# EAGLE design strobe-pcb (EAGLE 9.5.1)
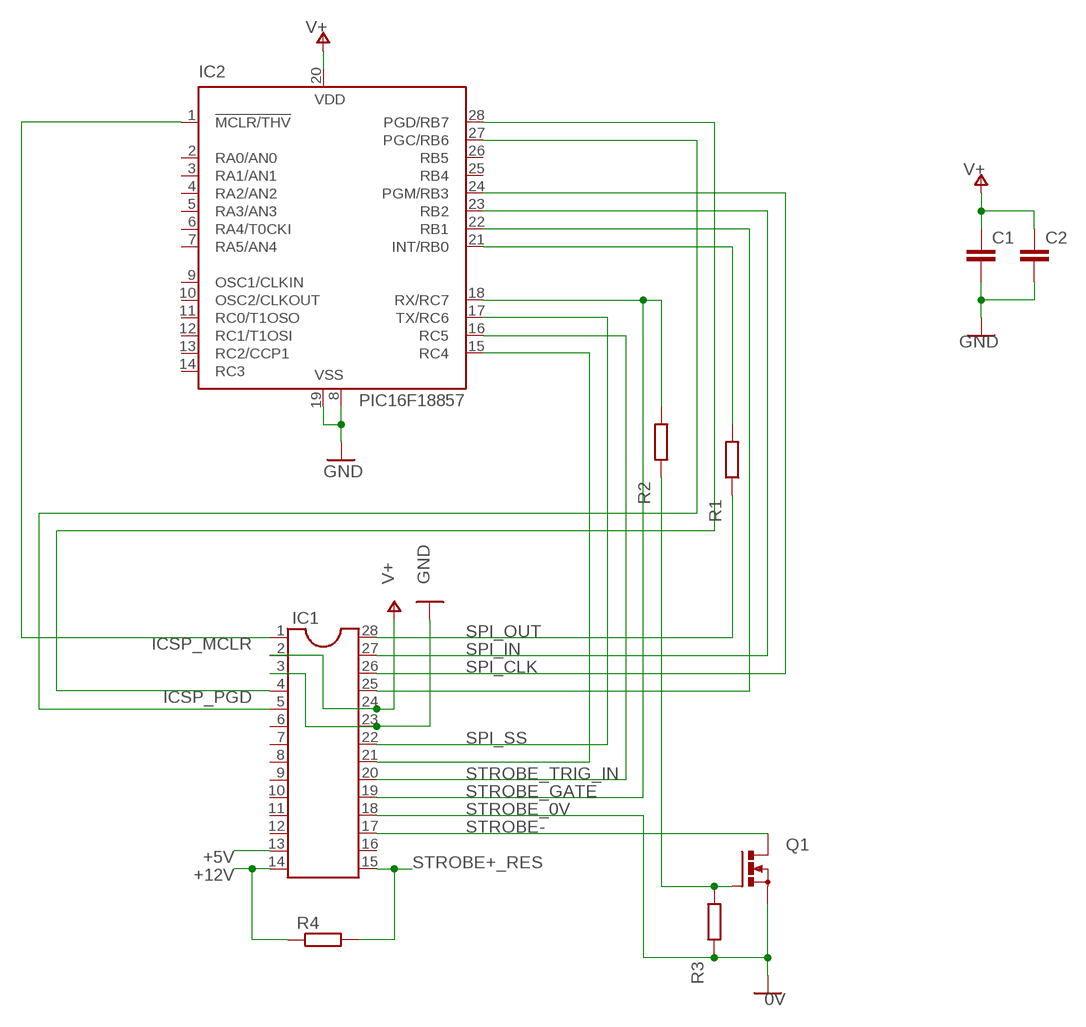
[diagram p0: schematic, sheet 1]

## Parts
C1  C-EUC1206  [C1206]
C2  C-EUC1206  [C1206]
IC1  DIL28  [DIL28-6]
IC2  PIC16F18857  PIC16F870SO  [SO28W]
Q1  PMOSFET_NTO220BV  [TO220BV]
R1  R-EU_R1206  [R1206]
R2  R-EU_R1206  [R1206]
R3  R-EU_R1206  [R1206]
R4  R-EU_0207/10  [0207/10]

## Nets
+5V: IC1.13
+12V: IC1.14 R4.1
GND: C1.2 C2.2 IC1.3 IC1.23 IC2.8(VSS) IC2.19(VSS)
ICSP_MCLR: IC1.1 IC2.1(!MCLR/THV)
ICSP_PGD: IC1.4 IC2.28(PGD/RB7)
N$1: IC1.25 IC2.22(RB1)
N$2: IC2.21(INT/RB0) R1.2
N$8: IC1.5 IC2.27(PGC/RB6)
N$12: Q1.G R2.1 R3.2
N$14: IC1.21 IC2.15(RC4)
SPI_CLK: IC1.26 IC2.24(PGM/RB3)
SPI_IN: IC1.27 IC2.23(RB2)
SPI_OUT: IC1.28 R1.1
SPI_SS: IC1.22 IC2.17(TX/RC6)
STROBE+_RES: IC1.15 R4.2
STROBE-: IC1.17 Q1.D
STROBE_0V: IC1.18 Q1.S R3.1 ; supply symbol labelled 0V
STROBE_GATE: IC1.19 IC2.18(RX/RC7) R2.2
STROBE_TRIG_IN: IC1.20 IC2.16(RC5)
V+: C1.1 C2.1 IC1.2 IC1.24 IC2.20(VDD)
Unconnected: IC1.6 IC1.7 IC1.8 IC1.9 IC1.10 IC1.11 IC1.12 IC1.16 IC2.2(RA0/AN0) IC2.3(RA1/AN1) IC2.4(RA2/AN2) IC2.5(RA3/AN3) IC2.6(RA4/T0CKI) IC2.7(RA5/AN4) IC2.9(OSC1/CLKIN) IC2.10(OSC2/CLKOUT) IC2.11(RC0/T1OSO) IC2.12(RC1/T1OSI) IC2.13(RC2/CCP1) IC2.14(RC3) IC2.25(RB4) IC2.26(RB5)

## Library data of the parts
C1 C2 = rcl:C-EU: CAPACITOR, European symbol; SPICEPREFIX: C
IC1 = ic-package:DIL28: Dual In Line
IC2 = microchip:PIC16*870: MICROCONTROLLER flash type; MF: MICROCHIP; MPN: PIC16F870-I/SO; OC_FARNELL: 9760946; OC_NEWARK: 61K3457
Q1 = transistor-power:PMOSFET_N: Power MOSFET N-Channel
R1-R4 = rcl:R-EU_: RESISTOR, European symbol; SPICEPREFIX: R

## Board
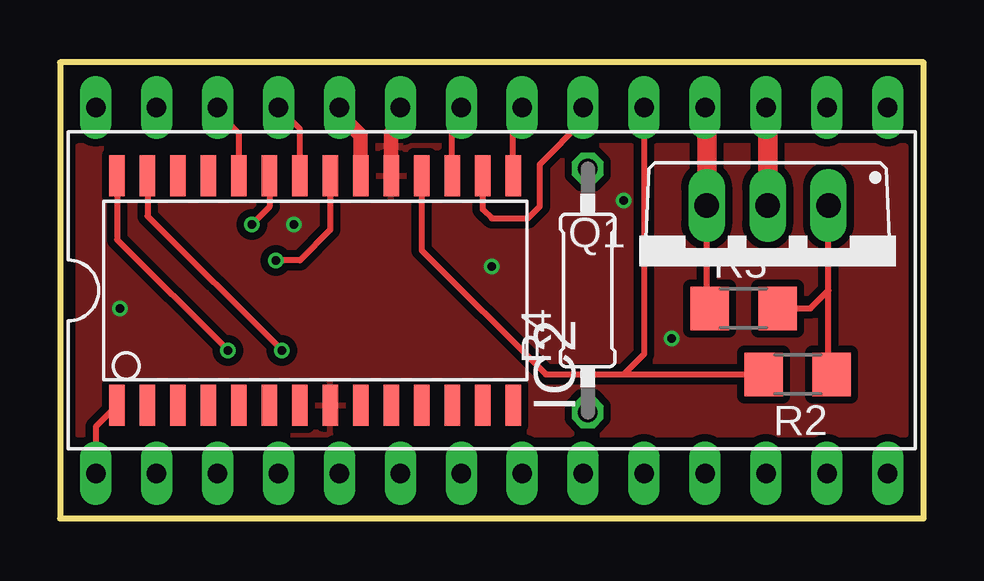
[diagram p1: board, top side]
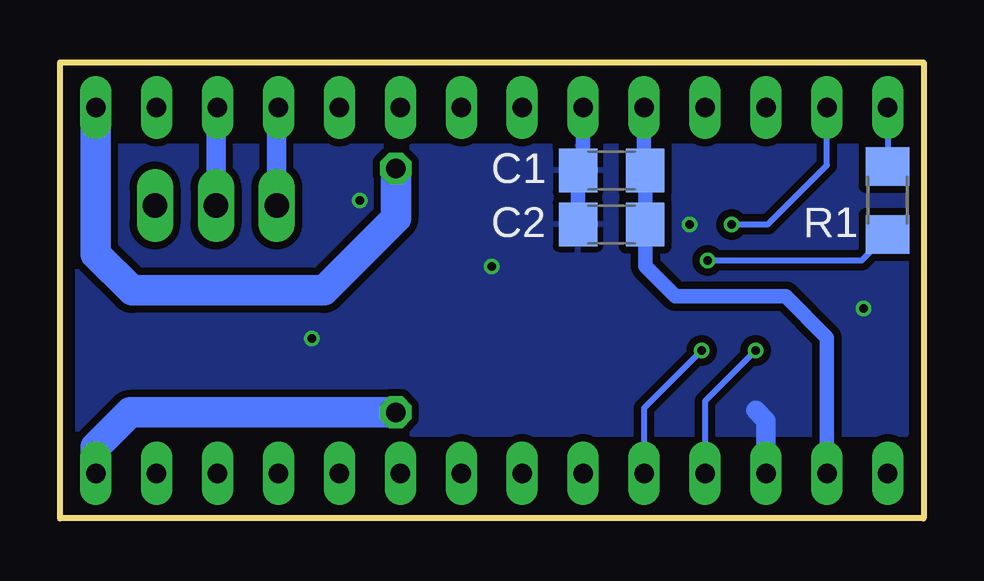
[diagram p2: board, bottom side, seen from below]

Size 36 x 19 mm. Coordinates in mm from the lower left corner, seen from the top.
Outline: 0,19 0,0 36,0 36,19 0,19
Copper layers (1*16): Top 0.035mm / dielectric 1.5mm / Bottom 0.035mm
Design rules "ITEADstudio_DRC": minimum track width 6mil, minimum drill 12mil, track to track 6mil, track to pad 6mil, pad to pad 6mil, via to via 6mil, smd to smd 0mil, copper to edge 10mil, drill to drill 10mil, minimum pad ring 10mil, minimum via ring 6mil, stop-mask expansion 2mil, vias tented up to drill 100mil, thermal gap 10mil

### Footprints (pad centres in the part's own frame; a part is rotated, then mirrored left to right if it is on the bottom)
C1206 = smd 1.6 x 1.8: 1 -1.4,0; 2 1.4,0
DIL28-6 = drill 0.813 long: 1 -16.51,-7.62; 2 -13.97,-7.62; 3 -11.43,-7.62; 4 -8.89,-7.62; 5 -6.35,-7.62; 6 -3.81,-7.62; 7 -1.27,-7.62; 8 1.27,-7.62; 9 3.81,-7.62; 10 6.35,-7.62; 11 8.89,-7.62; 12 11.43,-7.62; 13 13.97,-7.62; 14 16.51,-7.62; 15 16.51,7.62; 16 13.97,7.62; 17 11.43,7.62; 18 8.89,7.62; 19 6.35,7.62; 20 3.81,7.62; 21 1.27,7.62; 22 -1.27,7.62; 23 -3.81,7.62; 24 -6.35,7.62; 25 -8.89,7.62; 26 -11.43,7.62; 27 -13.97,7.62; 28 -16.51,7.62
SO28W = smd 0.65 x 1.7: 1 -7.62,-4.78; 2 -6.35,-4.78; 3 -5.08,-4.78; 4 -3.81,-4.78; 5 -2.54,-4.78; 6 -1.27,-4.78; 7 0,-4.78; 8 1.27,-4.78; 9 2.54,-4.78; 10 3.81,-4.78; 11 5.08,-4.78; 12 6.35,-4.78; 13 7.62,-4.78; 14 8.89,-4.78; 15 8.89,4.78; 16 7.62,4.78; 17 6.35,4.78; 18 5.08,4.78; 19 3.81,4.78; 20 2.54,4.78; 21 1.27,4.78; 22 0,4.78; 23 -1.27,4.78; 24 -2.54,4.78; 25 -3.81,4.78; 26 -5.08,4.78; 27 -6.35,4.78; 28 -7.62,4.78
TO220BV = drill 1.016 long: D 0,-2.54; G -2.54,-2.54; S 2.54,-2.54
R1206 = smd 1.6 x 1.803: 1 -1.422,0; 2 1.422,0
0207/10 = drill 0.813 octagon: 1 -5.08,0; 2 5.08,0

### Placement (x,y rotation side)
C1  13,14.5 180 bottom
C2  13,12.25 180 bottom
IC1  18,9.5 0 top
IC2  10,9.5 0 top
Q1  29.5,10.5 180 top
R1  1.5,13.25 270 bottom
R2  30.75,6 180 top
R3  28.5,8.75 0 top
R4  22,9.5 90 top

### Tracks (layer width: path | path; a pad name or v marks a point on that pad's centre or on a via)
+12V
  Bottom 1.27: R4.1 33.08,4.42 34.51,2.99 IC1.14
GND  (via drill 0.35)
  Top 0.61: IC1.23 14.25,17.06 14.25,16.5 13.81,16.06 IC2.19
  Bottom 0.61: IC1.23 14.19,14.71 C1.2 C2.2
  Bottom 0.813: IC1.3 6.57,4.07 7,4.5
  other vias: 2.5,8.75 9.75,12.25 18,10.5 23.5,13.25 25.5,7.5
  pour Top (isolate 0.305): 0.75,15.5 0.75,3.5 35.25,3.5 35.25,15.5
  pour Bottom (isolate 0.305): 0.75,15.5 0.75,3.5 35.25,3.5 35.25,15.5
ICSP_MCLR
  Top 0.254: IC2.1 1.49,3.83 IC1.1
ICSP_PGD  (via drill 0.35)
  Top 0.254: IC2.28 2.38,11.62 v7,7
  Bottom 0.254: v7,7 9.11,4.89 IC1.4
N$1
  Top 0.254: IC2.22 10,16.23 IC1.25
N$2  (via drill 0.35)
  Top 0.254: IC2.21 11.27,12.02 10,10.75 v9,10.75
  Bottom 0.254: v9,10.75 2.58,10.75 R1.2
N$8  (via drill 0.35)
  Top 0.254: IC2.27 3.65,12.6 v9.25,7
  Bottom 0.254: v9.25,7 11.65,4.6 IC1.5
N$12
  Top 0.254: R2.1 32.04,6.13 32.04,9.5 | 32.04,9.5 Q1.G | R3.2 31.29,8.75 32.04,9.5
N$14
  Top 0.254: IC2.15 18.89,16.74 IC1.21
SPI_CLK
  Top 0.254: IC2.24 7.46,16.04 6.57,16.93 IC1.26
SPI_IN  (via drill 0.35)
  Top 0.254: IC2.23 8.73,12.98 v8,12.25
  Bottom 0.254: v8,12.25 6.5,12.25 4.03,14.72 IC1.27
SPI_OUT
  Bottom 0.254: IC1.28 1.49,14.68 R1.1
SPI_SS
  Top 0.254: IC2.17 16.35,16.74 IC1.22
STROBE+_RES
  Bottom 1.27: R4.2 22,12.5 25,9.5 33,9.5 34.51,11.01 IC1.15
STROBE-
  Top 0.813: Q1.D 29.5,17.05 IC1.17
  Bottom 0.813: Q1.D 29.5,17.05 IC1.17
STROBE_0V
  Top 0.254: R3.1 26.96,8.87 Q1.S
  Top 0.813: Q1.S 26.96,17.05 IC1.18
  Bottom 0.813: Q1.S 26.96,17.05 IC1.18
STROBE_GATE
  Top 0.254: IC2.18 15.08,11.17 20.25,6 23.5,6 | 23.5,6 R2.2 | IC1.19 24.35,6.85 23.5,6
STROBE_TRIG_IN
  Top 0.254: IC2.16 17.62,12.88 18,12.5 19.5,12.5 20,13 20,14.75 21.81,16.56 IC1.20
V+
  Top 0.61: IC2.20 12.54,15.96 11.65,16.85 IC1.24
  Bottom 0.61: IC1.24 11.65,14.55 C1.1 C2.1 11.6,10.5 10.35,9.25 5.75,9.25 4.03,7.53 IC1.2